# Altium schematic sheet MicroDStripLine.SchDoc
size Letter
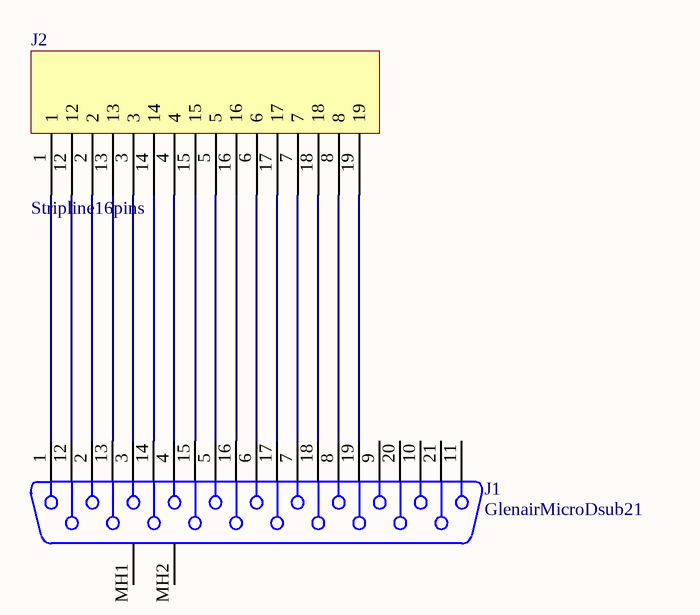
[diagram p0: MicroDStripLine.SchDoc]

## Parts
J1  GlenairMicroDsub21  [MicroD21Glenair]
J2  Stripline16pins  [Stripline16pins]

## Nets
NetJ1_1: J1.1 J2.1
NetJ1_2: J1.2 J2.2
NetJ1_3: J1.3 J2.3
NetJ1_4: J1.4 J2.4
NetJ1_5: J1.5 J2.5
NetJ1_6: J1.6 J2.6
NetJ1_7: J1.7 J2.7
NetJ1_8: J1.8 J2.8
NetJ1_12: J1.12 J2.12
NetJ1_13: J1.13 J2.13
NetJ1_14: J1.14 J2.14
NetJ1_15: J1.15 J2.15
NetJ1_16: J1.16 J2.16
NetJ1_17: J1.17 J2.17
NetJ1_18: J1.18 J2.18
NetJ1_19: J1.19 J2.19

Not connected (* = marked no-connect by the designer): J1 9 10 11 20 21 MH1 MH2

## Library data of the parts
J1 = GlenairMicroDsub21: PackageDescription: Connector; D-Sub, Thru-Hole; 9 Position; Vertical; Body 30.81 x 9.60 x 8.20 mm (LxWxH)